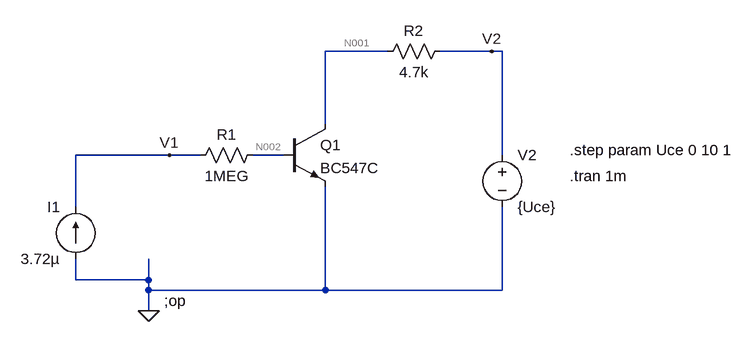
[diagram p0: schematic 1_Ic-Uce-characteristics_nolabels2.asc]
1_Ic-Uce-characteristics_nolabels2.asc, the LTspice schematic file:
Version 4
SHEET 1 1180 680
WIRE 560 -112 464 -112
WIRE 720 -112 640 -112
WIRE 736 -112 720 -112
WIRE 464 0 464 -112
WIRE 224 48 80 48
WIRE 272 48 224 48
WIRE 400 48 352 48
WIRE 736 48 736 -112
WIRE 80 128 80 48
WIRE 80 240 80 208
WIRE 192 240 192 208
WIRE 192 240 80 240
WIRE 192 256 192 240
WIRE 464 256 464 96
WIRE 464 256 192 256
WIRE 736 256 736 128
WIRE 736 256 464 256
WIRE 192 288 192 256
FLAG 192 288 0
FLAG 224 48 V1
FLAG 720 -112 V2
SYMBOL npn3 400 0 R0
SYMATTR InstName Q1
SYMATTR Value BC547C
SYMBOL res 368 32 R90
WINDOW 0 0 56 VBottom 2
WINDOW 3 32 56 VTop 2
SYMATTR InstName R1
SYMATTR Value 1MEG
SYMBOL res 656 -128 R90
WINDOW 0 0 56 VBottom 2
WINDOW 3 32 56 VTop 2
SYMATTR InstName R2
SYMATTR Value 4.7k
SYMBOL voltage 736 32 R0
WINDOW 123 0 0 Left 2
WINDOW 39 0 0 Left 2
SYMATTR InstName V2
SYMATTR Value {Uce}
SYMBOL current 80 208 R180
WINDOW 0 24 80 Left 2
WINDOW 3 24 0 Left 2
WINDOW 123 0 0 Left 2
WINDOW 39 0 0 Left 2
SYMATTR InstName I1
SYMATTR Value 3.72µ
TEXT 216 272 Left 2 !;op
TEXT 840 40 Left 2 !.step param Uce 0 10 1
TEXT 840 80 Left 2 !.tran 1m

The netlist it stands for:
* 1_Ic-Uce-characteristics_nolabels2.asc
Q1 N001 N002 0 0 BC547C
R1 N002 V1 1MEG
R2 V2 N001 4.7k
V2 V2 0 {Uce}
I1 0 V1 3.72µ
.model NPN NPN
.model PNP PNP
.lib standard.bjt
;op
.step param Uce 0 10 1
.tran 1m
.backanno
.end

* Results of the author's LTspice run, read from the files saved beside the schematic
* Operating Point (first step), zero values left out:
*   V(n001) = -1.331 mV
*   V(n002) = 532.1 mV
*   V(v1) = 4.252 V
*   Ic(Q1) = 283.2 nA
*   Ib(Q1) = 3.72 µA
*   Ie(Q1) = -4.003 µA
*   I(I1) = 3.72 µA
*   I(R2) = 283.2 nA
*   I(R1) = -3.72 µA
*   I(V2) = -283.2 nA
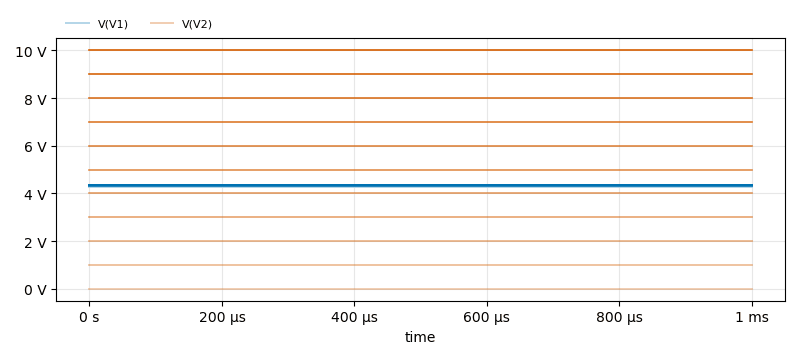
[diagram p1: Transient Analysis of 1_Ic-Uce-characteristics_nolabels2.asc, plotted from the saved traces]
* Transient Analysis, 21 runs:
*   V(V1) [run 1]: min 4.252 V, max 4.252 V, average 4.252 V, rms 4.252 V, last 4.252 V
*   V(V1) [run 2]: 4.303 V at time=0 s, 4.303 V at time=0 s, min 4.303 V, max 4.303 V
*   V(V1) [run 3]: min 4.303 V, max 4.303 V, average 4.303 V, rms 4.303 V, last 4.303 V
*   V(V1) [run 4]: min 4.32 V, max 4.32 V, average 4.32 V, rms 4.32 V, last 4.32 V
*   V(V1) [run 5]: 4.33 V at time=0 s, 4.33 V at time=0 s, min 4.33 V, max 4.33 V
*   V(V1) [run 6]: min 4.33 V, max 4.33 V, average 4.33 V, rms 4.33 V, last 4.33 V
*   V(V1) [run 7]: min 4.338 V, max 4.338 V, average 4.338 V, rms 4.338 V, last 4.338 V
*   V(V1) [run 8]: 4.343 V at time=0 s, 4.343 V at time=0 s, min 4.343 V, max 4.343 V
*   V(V2) [run 1]: min 0 V, max 0 V, average 0 V, rms 0 V, last 0 V
*   V(V2) [run 2]: 1 V at time=0 s, 1 V at time=0 s, min 1 V, max 1 V
*   V(V2) [run 3]: min 1 V, max 1 V, average 1 V, rms 1 V, last 1 V
*   V(V2) [run 4]: min 2 V, max 2 V, average 2 V, rms 2 V, last 2 V
*   V(V2) [run 5]: 3 V at time=0 s, 3 V at time=0 s, min 3 V, max 3 V
*   V(V2) [run 6]: min 3 V, max 3 V, average 3 V, rms 3 V, last 3 V
*   V(V2) [run 7]: min 4 V, max 4 V, average 4 V, rms 4 V, last 4 V
*   V(V2) [run 8]: 5 V at time=0 s, 5 V at time=0 s, min 5 V, max 5 V